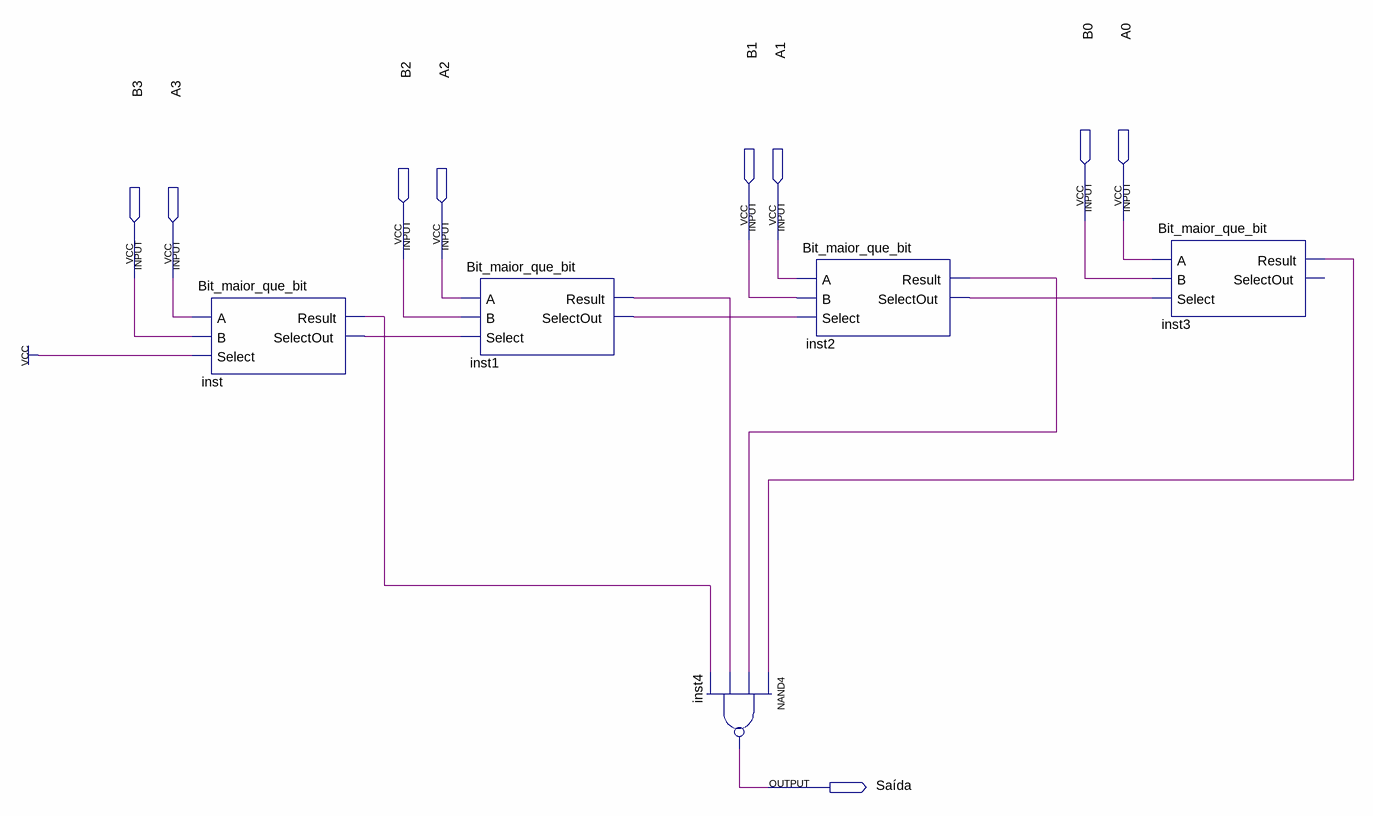
[diagram p0: schematic sheet]
// Quartus schematic Modulo_maior_que_modulo.bdf as structural Verilog: 5 symbols, 9 pins
module Modulo_maior_que_modulo (
  input  B0,
  input  A0,
  input  B1,
  input  A1,
  input  B2,
  input  A2,
  input  B3,
  input  A3,
  output \Saída 
);

  wire inst1_result, inst1_selectout, inst2_result, inst2_selectout, inst3_result, inst_result,
       inst_selectout;

  Bit_maior_que_bit inst (.A(A3), .B(B3), .Select(1'b1), .Result(inst_result), .SelectOut(inst_selectout));
  Bit_maior_que_bit inst1 (.A(A2), .B(B2), .Select(inst_selectout), .Result(inst1_result), .SelectOut(inst1_selectout));
  nand inst4 (\Saída , inst3_result, inst2_result, inst1_result, inst_result);
  Bit_maior_que_bit inst2 (
    .A(A1), .B(B1), .Select(inst1_selectout), .Result(inst2_result), .SelectOut(inst2_selectout));
  Bit_maior_que_bit inst3 (.A(A0), .B(B0), .Select(inst2_selectout), .Result(inst3_result));  // open: SelectOut
endmodule
